# EAGLE design spot_welder (EAGLE 7.7.0)
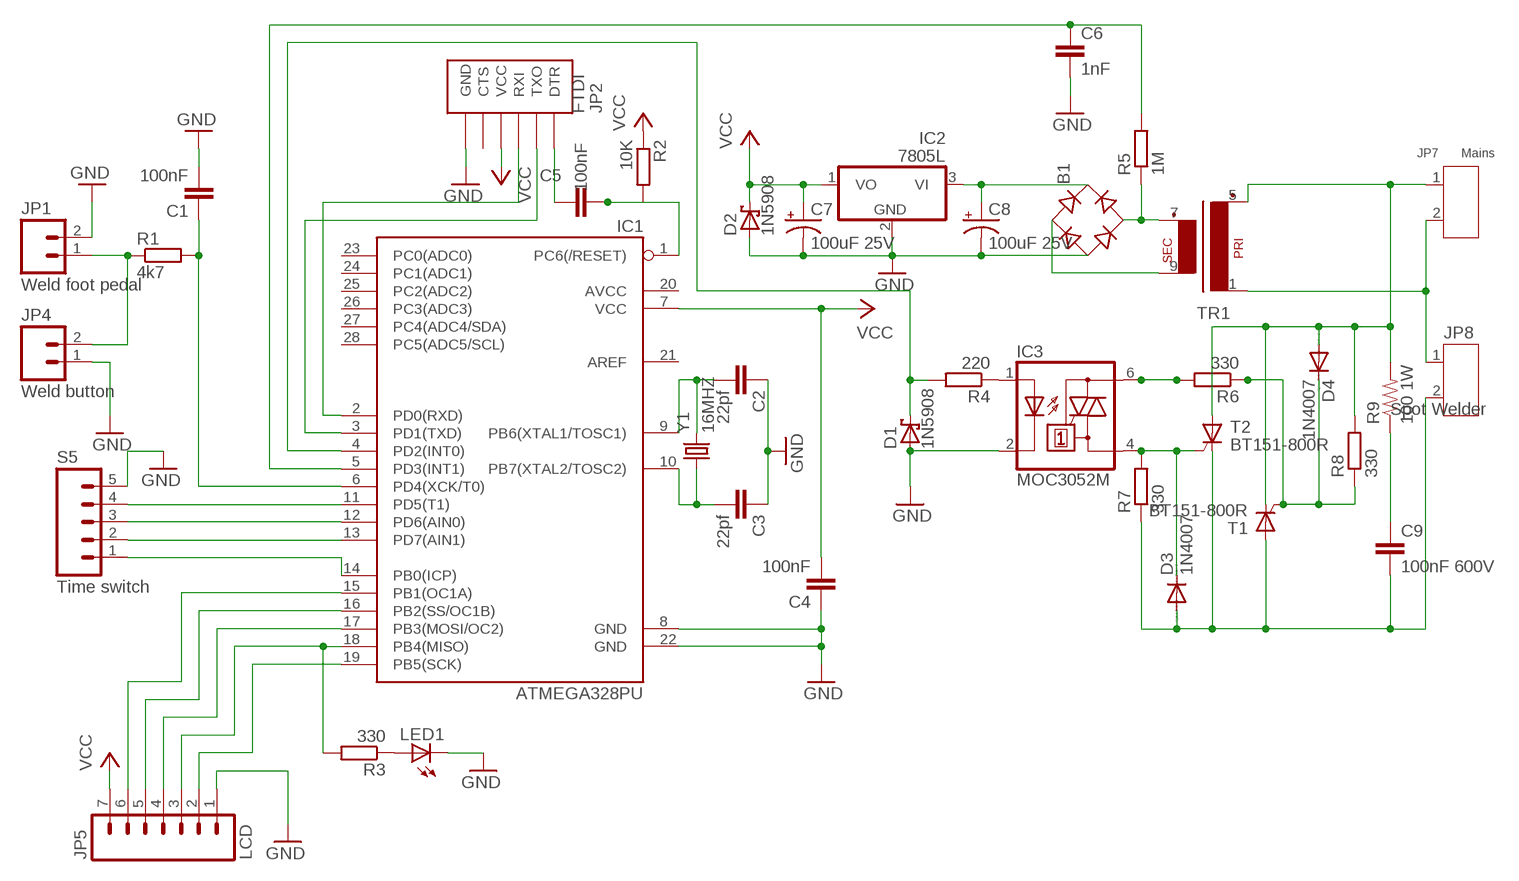
[diagram p0: schematic, sheet 1]

## Parts
B1  B-DIL  [B-DIL]
C1  100nF  CAPPTH1  [CAP-PTH-5MM]
C2  22pf  C-EU025-024X044  [C025-024X044]
C3  22pf  C-EU025-024X044  [C025-024X044]
C4  100nF  C-EU025-024X044  [C025-024X044]
C5  100nF  C-EU025-024X044  [C025-024X044]
C6  1nF  C-EU025-024X044  [C025-024X044]
C7  100uF 25V  CAP_POLPTH1  [CPOL-RADIAL-100UF-25V]
C8  100uF 25V  CAP_POLPTH1  [CPOL-RADIAL-100UF-25V]
C9  100nF 600V  C15/5  [C15B5]
D1  1N5908  [C4111-15]
D2  1N5908  [C4111-15]
D3  1N4007  1N4004  [DO41-10]
D4  1N4007  1N4004  [DO41-10]
IC1  ATMEGA328PU  ATMEGA328P_PDIP  [DIL28-3]
IC2  7805L  [TO92]
IC3  MOC3052M  MOC3023M  [DIL06]
JP1  Weld foot pedal  M02LOCK  [1X02_LOCK]
JP2  FTDI  FTDI_DEVICE  [FTDI_DEVICE_SIDE]
JP4  Weld button  M02LOCK  [1X02_LOCK]
JP5  LCD  M07NO_SILK  [1X07_NO_SILK]
JP7  Mains  SCREW-TERMINAL-BLUE(2P-5.0)  [H2-5.0-10.5X8.0MM]
JP8  Spot Welder  SCREW-TERMINAL-BLUE(2P-5.0)  [H2-5.0-10.5X8.0MM]
LED1  LEDLD260  [LD260]
R1  4k7  R-EU_0204/7  [0204/7]
R2  10K  R-EU_0204/7  [0204/7]
R3  330  R-EU_0204/7  [0204/7]
R4  220  R-EU_0204/7  [0204/7]
R5  1M  R-EU_0204/7  [0204/7]
R6  330  R-EU_0204/7  [0204/7]
R7  330  R-EU_0204/7  [0204/7]
R8  330  R-EU_0204/7  [0204/7]
R9  100 1W  RESISTORPTH-1W  [AXIAL-0.6]
S5  Time switch  M05NO_SILK  [1X05_NO_SILK]
T1  BT151-800R  TIC126  [TO220CS]
T2  BT151-800R  TIC126  [TO220CS]
TR1  EI30-1  [EI30-1]
Y1  16MHZ  CRYSTALHC49S  [HC49/S]

## Nets
GND: B1.- C1.2 C2.1 C3.1 C4.1 C6.2 C7.2(-) C8.2(-) D1.A D2.A IC1.8(GND) IC1.22(GND) IC2.2(GND) IC3.2(C) JP1.2 JP2.P$6(GND) JP4.1 JP5.1 LED1.K(C) S5.5
N$1: B1.AC2 R5.1 TR1.7(S3)
N$2: B1.+ C8.1(+) IC2.3(VI)
N$3: C9.2 D3.A JP8.2 R7.1 T1.A T2.C
N$4: B1.AC1 TR1.9(S4)
N$5: JP7.2 JP8.1 TR1.1
N$6: D3.C IC3.4(A1) R7.2 T2.G
N$7: C5.1 JP2.P$1(DTR)
N$8: IC3.6(A2) R6.2
N$9: IC3.1(A) R4.1
N$10: D4.A JP7.1 R8.2 R9.P$2 T1.C T2.A TR1.5(P2)
N$11: C9.1 R9.P$1
N$12: D4.C R6.1 R8.1 T1.G
N$13: C6.1 IC1.5(PD3(INT1)) R5.2
N$14: C5.2 IC1.1(PC6(/RESET)) R2.2
N$15: D1.C IC1.4(PD2(INT0)) R4.2
N$16: C2.2 IC1.9(PB6(XTAL1/TOSC1)) Y1.2
N$17: C3.2 IC1.10(PB7(XTAL2/TOSC2)) Y1.1
N$18: IC1.11(PD5(T1)) S5.4
N$19: IC1.3(PD1(TXD)) JP2.P$2(TXO)
N$20: IC1.2(PD0(RXD)) JP2.P$3(RXI)
N$21: JP1.1 JP4.2 R1.1
N$22: C1.1 IC1.6(PD4(XCK/T0)) R1.2
N$23: IC1.12(PD6(AIN0)) S5.3
N$24: IC1.13(PD7(AIN1)) S5.2
N$25: IC1.14(PB0(ICP)) S5.1
N$26: LED1.A R3.1
N$27: IC1.18(PB4(MISO)) JP5.3 R3.2
N$28: IC1.15(PB1(OC1A)) JP5.6
N$29: IC1.16(PB2(SS/OC1B)) JP5.5
N$30: IC1.17(PB3(MOSI/OC2)) JP5.4
N$31: IC1.19(PB5(SCK)) JP5.2
VCC: C4.2 C7.1(+) D2.C IC1.7(VCC) IC2.1(VO) JP2.P$4(VCC) JP5.7 R2.1
Unconnected: IC1.20(AVCC) IC1.21(AREF) IC1.23(PC0(ADC0)) IC1.24(PC1(ADC1)) IC1.25(PC2(ADC2)) IC1.26(PC3(ADC3)) IC1.27(PC4(ADC4/SDA)) IC1.28(PC5(ADC5/SCL)) JP2.P$5(CTS)

## Library data of the parts
B1 = rectifier:B-DIL: RECTIFIER
C1 = SparkFun-Passives:CAP: Capacitor Standard 0603 ceramic capacitor, and 0.1" leaded capacitor.
C2-C6 = rcl:C-EU: CAPACITOR, European symbol
C7 C8 = SparkFun-Capacitors:CAP_POL: Capacitor Polarized These are standard SMD and PTH capacitors. Normally 10uF, 47uF, and 100uF in electrolytic and tantalum varieties. Always verify the external diameter of the through hole cap, it varies with capacity, voltage, and manufacturer. The EIA devices should be standard.
C9 = capacitor-wima:C: CAPACITOR naming: grid - package width
D1 D2 = diode:1N5908: DIODE schottky
D3 D4 = diode:1N4004: DIODE general purpose rectifier, 1 A
IC1 = SparkFun-DigitalIC:ATMEGA328P_PDIP: uC used in the Arduino 32kb flash, 1k EEPROM, 2k SRAM This is the through-hole version of this chip.
IC2 = linear:78*: Positive VOLTAGE REGULATOR Source: http://cache.national.com/ds/LM/LM78L05.pdf http://www.fairchildsemi.com/ds/LM/LM7805.pdf
IC3 = optocoupler:MOC30*M: RANDOM-PHASE OPTOISOLATORS TRIAC DRIVER OUTPUT Source: http://www.fairchildsemi.com MOC3020-M.pdf; MF: FAIRCHILD SEMICONDUCTOR; MPN: MOC3023-M; OC_FARNELL: 1021367; OC_NEWARK: 72K8896
JP1 JP4 = SparkFun-Connectors:M02: Standard 2-pin 0.1" header. Use with - straight break away headers ( PRT-00116) - right angle break away headers (PRT-00553) - swiss pins (PRT-00743) - machine pins (PRT-00117) - female headers (PRT-00115) Molex polarized connector foot print use with: PRT-08233 with associated crimp pins and housings. 2.54_SCREWTERM for use with PRT-10571. 3.5mm Screw Terminal footprints for PRT-08084 5mm Screw Terminal footprints for use with PRT-08432
JP2 = SparkFun-Connectors:FTDI_DEVICE: Connector which mates to FTDI basic or FTDI cable.
JP5 = SparkFun-Connectors:M07: Header 7 Standard 7-pin 0.1" header. Use with straight break away headers (SKU : PRT-00116), right angle break away headers (PRT-00553), swiss pins (PRT-00743), machine pins (PRT-00117), and female headers (PRT-00115). NOTES ON THE VARIANTS LOCK and LOCK_LONGPADS... This footprint was designed to help hold the alignment of a through-hole component (i.e. 7-pin header) while soldering it into place. You may notice that each hole has been shifted either up or down by 0.005 of an inch from it's more standard position (which is usually a perfectly straight line). This slight alteration caused the pins (the squares in the middle) to touch the edges of the holes. Because they are alternating, it causes a "brace" to hold the header in place. 0.005 has proven to be the perfect amount of "off-center" position when using our standard breakaway headers. Although looks a little odd when you look at the bare footprint, once you have a header in there, the alteration is very hard to notice. Also, if you push a header all the way into place, it is covered up entirely on the bottom side. This idea of altering the position of holes to aid alignment will be further integrated into the Sparkfun Library for other footprints. It can help hold any component with 3 or more connection pins.
JP7 JP8 = Seeed-OPL-Connector:SCREW-TERMINAL-BLUE(2P-5.0): 320120007; MPN: GSL009-5.0-02P-12; VALUE: GSL009-5.0-02P-12
LED1 = led:LED: LED OSRAM: - CHIPLED LG R971, LG N971, LY N971, LG Q971, LY Q971, LO R971, LY R971 LH N974, LH R974 LS Q976, LO Q976, LY Q976 LO Q996 - Hyper CHIPLED LW Q18S LB Q993, LB Q99A, LB R99A - SideLED LS A670, LO A670, LY A670, LG A670, LP A670 LB A673, LV A673, LT A673, LW A673 LH A674 LY A675 LS A676, LA A676, LO A676, LY A676, LW A676 LS A679, LY A679, LG A679 - Hyper Micro SIDELED® LS Y876, LA Y876, LO Y876, LY Y876 LT Y87S - SmartLED LW L88C, LW L88S LB L89C, LB L89S, LG L890 LS L89K, LO L89K, LY L89K LS L896, LA L896, LO L896, LY L896 - TOPLED LS T670, LO T670, LY T670, LG T670, LP T670 LSG T670, LSP T670, LSY T670, LOP T670, LYG T670 LG T671, LOG T671, LSG T671 LB T673, LV T673, LT T673, LW T673 LH T674 LS T676, LA T676, LO T676, LY T676, LB T676, LH T676, LSB T676, LW T676 LB T67C, LV T67C, LT T67C, LS T67K, LO T67K, LY T67K, LW E67C LS E67B, LA E67B, LO E67B, LY E67B, LB E67C, LV E67C, LT E67C LW T67C LS T679, LY T679, LG T679 LS T770, LO T770, LY T770, LG T770, LP T770 LB T773, LV T773, LT T773, LW T773 LH T774 LS E675, LA E675, LY E675, LS T675 LS T776, LA T776, LO T776, LY T776, LB T776 LHGB T686 LT T68C, LB T68C - Hyper Mini TOPLED® LB M676 - Mini TOPLED Santana® LG M470 LS M47K, LO M47K, LY M47K Source: http://www.osram.convergy.de LUXEON: - LUMILED® LXK2-PW12-R00, LXK2-PW12-S00, LXK2-PW14-U00, LXK2-PW14-V00 LXK2-PM12-R00, LXK2-PM12-S00, LXK2-PM14-U00 LXK2-PE12-Q00, LXK2-PE12-R00, LXK2-PE12-S00, LXK2-PE14-T00, LXK2-PE14-U00 LXK2-PB12-K00, LXK2-PB12-L00, LXK2-PB12-M00, LXK2-PB14-N00, LXK2-PB14-P00, LXK2-PB14-Q00 LXK2-PR12-L00, LXK2-PR12-M00, LXK2-PR14-Q00, LXK2-PR14-R00 LXK2-PD12-Q00, LXK2-PD12-R00, LXK2-PD12-S00 LXK2-PH12-R00, LXK2-PH12-S00 LXK2-PL12-P00, LXK2-PL12-Q00, LXK2-PL12-R00 Source: www.luxeon.com KINGBRIGHT: KA-3528ASYC Source: www.kingbright.com
R1-R8 = rcl:R-EU_: RESISTOR, European symbol
R9 = SparkFun-Passives:RESISTOR: Resistor Basic schematic elements and footprints for 0603, 1206, and PTH resistors.
S5 = SparkFun-Connectors:M05: Header 5 Standard 5-pin 0.1" header. Use with straight break away headers (SKU : PRT-00116), right angle break away headers (PRT-00553), swiss pins (PRT-00743), machine pins (PRT-00117), and female headers (PRT-00115). Molex polarized connector foot print use with SKU : PRT-08230 with associated crimp pins and housings.
T1 T2 = triac:TIC126: THYRISTOR
TR1 = trafo:EI30-1: TRANSFORMER 1 primary winding, 1 secondary winding ERA
Y1 = crystal:CRYSTAL: CRYSTAL; OC_FARNELL: 1667008; OC_NEWARK: unknown

## Net classes
0 default: clearance 0.205 mm

## Board
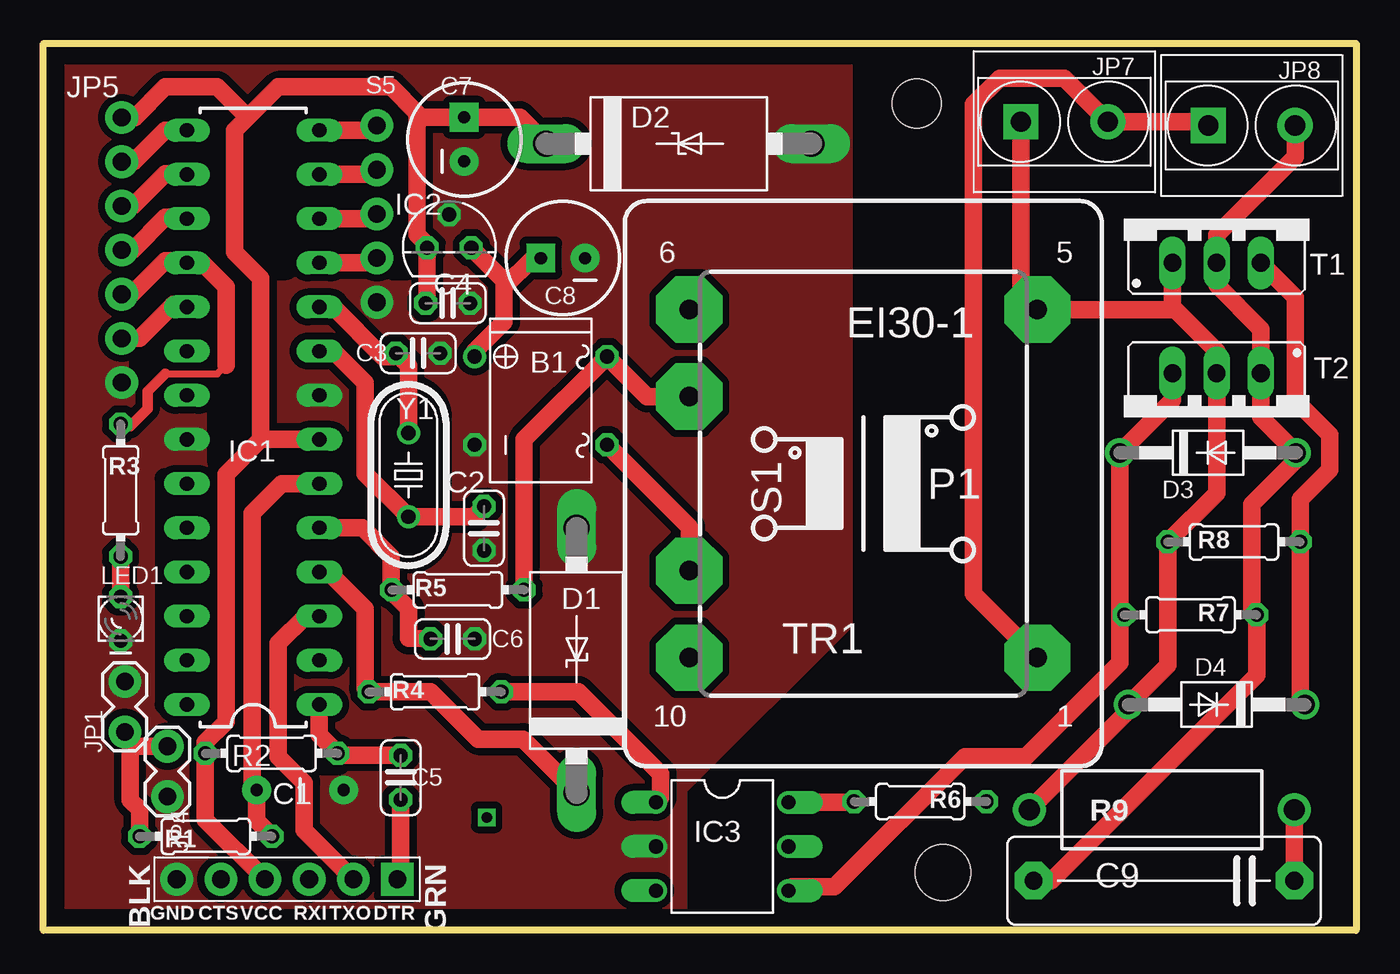
[diagram p1: board, top side]
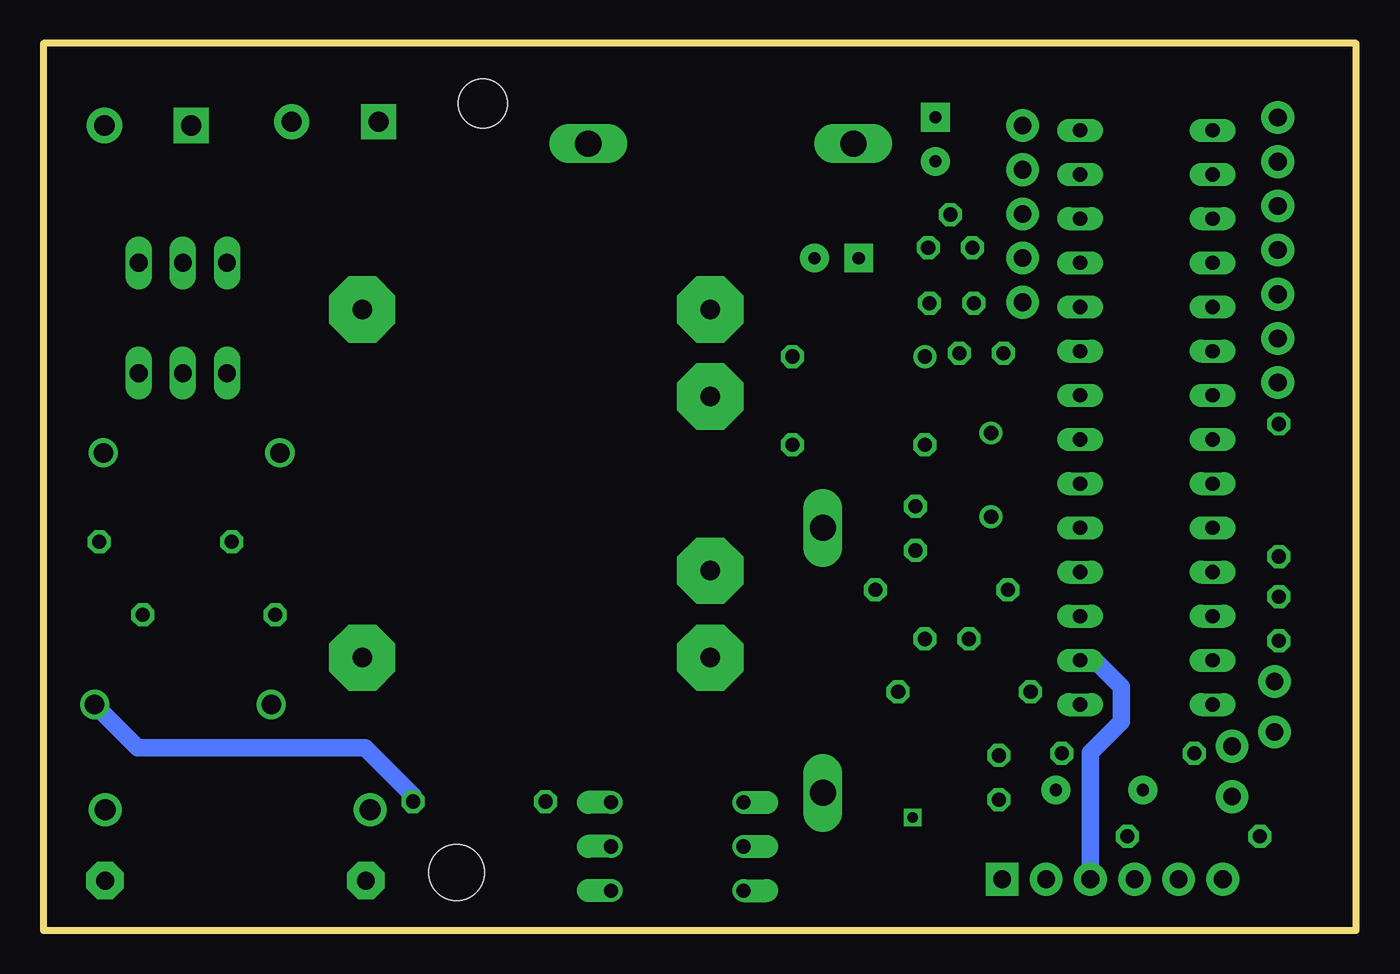
[diagram p2: board, bottom side, seen from below]

Size 75.5 x 51 mm. Coordinates in mm from the lower left corner, seen from the top.
Outline: 75.5,51 75.5,0 0,0 0,51 75.5,51
Copper layers (1*16): Top 0.035mm / dielectric 1.5mm / Bottom 0.035mm
Design rules "default": minimum track width 10mil, minimum drill 24mil, track to track 8mil, track to pad 8mil, pad to pad 8mil, via to via 8mil, smd to smd 8mil, copper to edge 40mil, drill to drill 8mil, minimum pad ring 10mil, minimum via ring 8mil, stop-mask expansion 4mil, vias tented up to drill 0mil, thermal gap 10mil
Holes 3.2 mm at 51.74,3.33
Holes 2.8 mm at 50.24,47.55
tRestrict: 13 lines

### Footprints (pad centres in the part's own frame; a part is rotated, then mirrored left to right if it is on the bottom)
B-DIL = drill 0.813: + -2.54,-3.81 | drill 0.813 octagon: - 2.54,-3.81; AC1 2.54,3.81; AC2 -2.54,3.81
CAP-PTH-5MM = drill 0.7 pad 1.651: 1 -2.5,0; 2 2.5,0
C025-024X044 = drill 0.813 octagon: 1 -1.27,0; 2 1.27,0
CPOL-RADIAL-100UF-25V = drill 0.7 pad 1.651 square: 1 1.27,0 | drill 0.7 pad 1.651: 2 -1.27,0
C15B5 = drill 1.016 pad 2.159 octagon: 1 -7.493,0; 2 7.493,0
C4111-15 = drill 1.499 long: A 7.62,0; C -7.62,0
DO41-10 = drill 1.118: A 5.08,0; C -5.08,0
DIL28-3 = drill 0.813 long: 1 -16.51,-3.81; 2 -13.97,-3.81; 3 -11.43,-3.81; 4 -8.89,-3.81; 5 -6.35,-3.81; 6 -3.81,-3.81; 7 -1.27,-3.81; 8 1.27,-3.81; 9 3.81,-3.81; 10 6.35,-3.81; 11 8.89,-3.81; 12 11.43,-3.81; 13 13.97,-3.81; 14 16.51,-3.81; 15 16.51,3.81; 16 13.97,3.81; 17 11.43,3.81; 18 8.89,3.81; 19 6.35,3.81; 20 3.81,3.81; 21 1.27,3.81; 22 -1.27,3.81; 23 -3.81,3.81; 24 -6.35,3.81; 25 -8.89,3.81; 26 -11.43,3.81; 27 -13.97,3.81; 28 -16.51,3.81
TO92 = drill 0.813 octagon: 1 -1.27,0; 2 0,1.905; 3 1.27,0
DIL06 = drill 0.813 offset: 1 -2.54,-3.81; 2 0,-3.81; 3 2.54,-3.81; 4 2.54,3.81; 5 0,3.81; 6 -2.54,3.81
1X02_LOCK = drill 1.016 pad 1.88: 1 -0.178,0; 2 2.718,0
FTDI_DEVICE_SIDE = drill 1.016 pad 1.88 square: P$1 -6.35,0 | drill 1.016 pad 1.88: P$2 -3.81,0; P$3 -1.27,0; P$4 1.27,0; P$5 3.81,0; P$6 6.35,0
1X07_NO_SILK = drill 1.016 pad 1.88: 1 0,0; 2 2.54,0; 3 5.08,0; 4 7.62,0; 5 10.16,0; 6 12.7,0; 7 15.24,0
H2-5.0-10.5X8.0MM = drill 1.168 pad 2.032 square: 1 0,2.5 | drill 1.168 pad 2.032: 2 0,-2.5
LD260 = drill 0.813 octagon: A -1.27,0; K 1.27,0
0204/7 = drill 0.813 octagon: 1 -3.81,0; 2 3.81,0
AXIAL-0.6 = drill 1.2 pad 1.88: P$1 -7.62,0; P$2 7.62,0
1X05_NO_SILK = drill 1.016 pad 1.88: 1 0,0; 2 2.54,0; 3 5.08,0; 4 7.62,0; 5 10.16,0
TO220CS = drill 1.016 long: A 0,-2.54; C -2.54,-2.54; G 2.54,-2.54
EI30-1 = drill 1.118 pad 3.81 octagon: 1 -10.008,10.008; 5 -10.008,-10.008; 6 10.008,-10.008; 7 10.008,-5.004; 9 10.008,5.004; 10 10.008,10.008
HC49/S = drill 0.813: 1 -2.413,0; 2 2.413,0

### Placement (x,y rotation side)
B1  28.61,30.46 270 top
C1  14.76,8.08 0 top
C2  25.34,23.12 90 top
C3  21.55,33.19 180 top
C4  23.26,36.07 180 top
C5  20.55,8.79 90 top
C6  23.53,16.76 0 top
C7  24.2,45.49 90 top
C8  29.88,38.66 180 top
C9  64.46,2.86 180 top
D1  30.67,15.53 90 top
D2  36.54,45.24 0 top
D3  66.98,27.46 0 top
D4  67.48,12.99 180 top
IC1  12.06,29.5 90 top
IC2  23.34,39.26 0 top
IC3  39.04,4.83 270 top
JP1  4.68,11.59 90 top
JP2  14.01,2.94 180 top
JP4  7.13,7.87 90 top
JP5  4.5,31.5 90 top
JP7  58.72,46.5 90 top
JP8  69.5,46.28 90 top
LED1  4.44,17.92 270 top
R1  9.34,5.41 0 top
R2  13.12,10.18 0 top
R3  4.44,25.31 90 top
R4  22.53,13.72 180 top
R5  23.84,19.58 180 top
R6  50.43,7.41 180 top
R7  65.98,18.15 180 top
R8  68.48,22.34 180 top
R9  64.33,6.94 180 top
S5  19.18,46.28 270 top
T1  67.48,40.93 0 top
T2  67.48,29.5 180 top
TR1  47.16,25.69 180 top
Y1  20.99,26.19 270 top

### Tracks (layer width: path | path; a pad name or v marks a point on that pad's centre or on a via)
GND
  pour Top (isolate 0.406, no thermals): -0.5,52 46.5,52 46.5,17.5 37,8 37,-1.5 0,-1.5
N$1
  Top 1.016: TR1.7 34.73,30.69 B1.AC2 27.65,28.23 R5.1
N$2
  Top 1.016: B1.+ 24.8,33.3 26.5,35 26.5,37 | 26.5,37 26.5,37.37 IC2.3 | C8.1 28.16,38.66 26.5,37
N$3
  Top 1.016: JP8.2 72,44.5 67.5,40 67.5,38.41 T1.A 67.48,37.12 70.02,34.58 T2.C 70.02,29.5 D3.A 72.06,27.06 69.5,24.5 69.5,18.44 R7.1 69.79,14.69 57.96,2.86 C9.2
N$4
  Top 1.016: TR1.9 37.15,23.19 B1.AC1
N$5
  Top 1.016: TR1.1 53.5,19.35 53.5,47.5 55,49 58.72,49 JP7.2 66.78,46.5 JP8.1
N$6
  Top 1.016: T2.G 64.94,30.5 D3.C 61.9,18.42 | 61.9,18.42 R7.2 | 61.9,18.42 61.9,15.4 56.5,10 53,10 45.5,2.5 43.06,2.5 IC3.4
N$7
  Top 1.016: C5.1 20.55,3.13 JP2.P$1
N$8
  Top 1.016: IC3.6 46.58,7.37 R6.2
N$9
  Top 1.016: R4.1 30.78,13.72 35.5,9 35.5,7.64 IC3.1
N$10
  Top 1.016: 65.09,35.7 67.48,33.31 T2.A 67.48,25.15 R8.2 64.67,15.26 D4.A 62.4,12.63 R9.P$2 | 65.09,35.7 64.94,35.85 T1.C | 57.22,35.75 TR1.5 | JP7.1 56.22,36.64 TR1.5 | TR1.5 65.09,35.7
N$11
  Top 1.016: R9.P$1 C9.1
N$12
  Top 1.016: T1.G 72,36.41 72,30.5 74,28.5 74,26.5 72.29,24.79 R8.1 72.29,13.26 D4.C
  Bottom 1.016: R6.1 54.24,7.74 57,10.5 70.07,10.5 D4.C
N$13
  Top 1.016: IC1.5 18.35,23.15 20,21.5 20,19.61 R5.2 20.03,19.47 21,18.5 21,16.79 C6.1
N$14
  Top 1.016: IC1.1 15.87,11.24 R2.2 17.05,10.06 C5.2
N$15
  Top 1.016: IC1.4 16.39,20.61 18.5,18.5 18.5,13.94 R4.2 22.28,13.72 25,11 27.58,11 D1.C
N$16
  Top 1.016: IC1.9 16.69,33.31 18.5,31.5 18.5,26.27 Y1.2 24.73,23.78 C2.2
N$17
  Top 1.016: Y1.1 20.99,32.48 C3.2 20.09,33 19.5,33 16.65,35.85 IC1.10
N$18
  Top 1.016: IC1.11 18.91,38.39 S5.4
N$19
  Top 1.016: IC1.3 15.07,18.07 13.5,16.5 13.5,10 15,8.5 15,5.76 JP2.P$2
N$20
  Bottom 1.016: JP2.P$3 15.28,10.22 13.5,12 13.5,14 15,15.5 15.84,15.5 IC1.2
N$21
  Top 1.016: R1.1 5.53,6.97 5,7.5 5,10.59 | JP1.1 5,11.09 5,11 5,10.59 | JP4.2 5,10.59
N$22
  Top 1.016: IC1.6 13.69,25.69 12,24 12,8.34 C1.1 12.26,6.3 R1.2
N$23
  Top 1.016: IC1.12 18.91,40.93 S5.3
N$24
  Top 1.016: IC1.13 18.91,43.47 S5.2
N$25
  Top 1.016: IC1.14 18.91,46.01 S5.1
N$26
  Top 1.016: R3.1 LED1.A
N$27
  Top 0.406: 4.5,29 5,29 | 9,38.5 8.36,38.5 | 7,32 10,32 10.5,32.5
  Top 0.61: 5,29 6,30 6,31 7,32
  Top 1.016: JP5.3 5.08,36.58 7,38.5 8.14,38.5 IC1.18 8.36,38.5 | R3.2 4.44,29.06 4.5,29 | 9,38.5 10.5,37 10.5,32.5
N$28
  Top 1.016: JP5.6 5.2,44.2 7,46 IC1.15
N$29
  Top 1.016: JP5.5 5.16,41.66 7,43.5 8.22,43.5 IC1.16
N$30
  Top 1.016: JP5.4 5.12,39.12 7,41 8.18,41 IC1.17
N$31
  Top 1.016: JP5.2 5.54,34.04 7.5,36 8.1,36 IC1.19
N$32  (via drill 0.6)
  other vias: 25.5,6.5
VCC
  Top 1.016: C4.2 22.07,36.65 IC2.1 22.07,39.43 21.5,40 21.5,47 | 21.5,47 20,48.5 13.5,48.5 11.75,46.75 | JP5.7 5.24,46.74 7,48.5 10,48.5 11.75,46.75 | JP2.P$4 9.31,6.37 R2.1 9.31,10.81 10.5,12 10.5,26.23 12.5,28.23 12.5,28.5 | IC1.7 12.77,28.23 12.5,28.5 | 21.5,47 21.74,46.76 C7.1 27.4,46.76 D2.C | 11.75,46.75 11,46 11,39 12.5,37.5 12.5,28.5